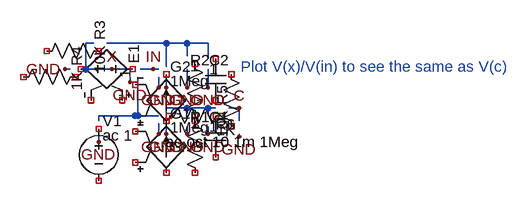
[diagram p0: schematic venableTrue.asc]
venableTrue.asc, the LTspice schematic file:
Version 3
SHEET 1 892 692
WIRE 400 300 400 288
WIRE 400 268 400 260
WIRE 400 260 432 260
WIRE 464 260 464 272
WIRE 464 288 464 300
WIRE 432 300 432 288
WIRE 432 268 432 260
WIRE 432 260 464 260
WIRE 388 300 388 284
WIRE 296 272 356 272
WIRE 400 228 400 216
WIRE 400 196 400 160
WIRE 464 160 464 184
WIRE 464 200 464 228
WIRE 432 228 432 200
WIRE 432 180 432 160
WIRE 388 228 388 212
WIRE 244 200 252 200
WIRE 272 200 276 200
WIRE 276 200 276 160
WIRE 276 200 316 200
WIRE 276 160 288 160
WIRE 432 160 464 160
WIRE 296 272 296 280
WIRE 296 300 296 312
WIRE 344 212 344 220
WIRE 356 212 356 272
WIRE 356 272 388 272
WIRE 380 200 388 200
WIRE 308 160 400 160
WIRE 400 160 432 160
WIRE 496 260 512 260
WIRE 464 260 476 260
WIRE 512 260 512 280
WIRE 512 300 512 304
WIRE 360 200 380 200
WIRE 316 200 340 200
FLAG 400 300 GND
FLAG 432 300 GND
FLAG 464 300 GND
FLAG 388 300 GND
FLAG 400 228 GND
FLAG 432 228 GND
FLAG 464 228 GND
FLAG 388 228 GND
FLAG 244 200 GND
FLAG 296 312 GND
FLAG 344 220 GND
FLAG 380 200 IN
FLAG 512 260 C
FLAG 512 304 GND
FLAG 316 200 X
SYMBOL G2 400 264 R0
WINDOW 0 6 4 Left 0
WINDOW 3 6 26 Left 0
SYMATTR InstName G1
SYMATTR Value 1Meg
SYMBOL res 428 264 R0
WINDOW 0 9 10 Left 0
WINDOW 3 9 19 Left 0
SYMATTR InstName R1
SYMATTR Value 1
SYMBOL cap 460 272 R0
WINDOW 0 6 2 Left 0
WINDOW 3 6 16 Left 0
SYMATTR InstName C1
SYMATTR Value 1
SYMBOL g2 400 192 R0
WINDOW 0 6 4 Left 0
WINDOW 3 6 26 Left 0
SYMATTR InstName G2
SYMATTR Value 1Meg
SYMBOL res 428 176 R0
WINDOW 0 9 10 Left 0
WINDOW 3 9 19 Left 0
SYMATTR InstName R2
SYMATTR Value 1
SYMBOL cap 460 184 R0
WINDOW 0 6 2 Left 0
WINDOW 3 6 16 Left 0
SYMATTR InstName C2
SYMATTR Value 1
SYMBOL res 312 156 R90
WINDOW 0 0 14 Right 0
WINDOW 3 8 14 Left 0
SYMATTR InstName R3
SYMATTR Value 10K
SYMBOL res 276 196 R90
WINDOW 0 0 14 Right 0
WINDOW 3 8 14 Left 0
SYMATTR InstName R4
SYMATTR Value 1K
SYMBOL voltage 296 276 R0
WINDOW 0 6 4 Left 0
WINDOW 3 6 26 Left 0
SYMATTR InstName V1
SYMATTR Value ac 1
SYMBOL e 364 200 M270
WINDOW 0 9 14 Left 0
WINDOW 3 -14 27 Left 0
SYMATTR InstName E1
SYMATTR Value 1
SYMBOL res 500 256 R90
WINDOW 0 0 14 Right 0
WINDOW 3 8 14 Left 0
SYMATTR InstName R5
SYMATTR Value 10K
SYMBOL res 516 304 R180
WINDOW 0 9 19 Left 0
WINDOW 3 9 10 Left 0
SYMATTR InstName R6
SYMATTR Value 1K
text 392 312 Left 0 !.ac oct 10 1m 1Meg
text 514 196 Left 0 ;Plot V(x)/V(in) to see the same as V(c)

The netlist it stands for:
* venableTrue.asc
* G1: 1Meg (symbol G2 not certain, pin order unknown); nets seen at it: 
R1 NC_05 NC_06 1
C1 NC_07 NC_08 1
* G2: 1Meg (symbol g2 not certain, pin order unknown); nets seen at it: GND, N002
R2 NC_11 NC_12 1
C2 NC_13 NC_14 1
R3 NC_15 NC_16 10K
R4 NC_17 NC_18 1K
V1 NC_19 NC_20 ac 1
* E1: 1 (symbol e not certain, pin order unknown); nets seen at it: 
R5 NC_25 NC_26 10K
R6 NC_27 NC_28 1K
.ac oct 10 1m 1Meg
* Plot V(x)/V(in) to see the same as V(c)
.backanno
.end